# EAGLE design rx_315mhz (EAGLE 7.6.0)
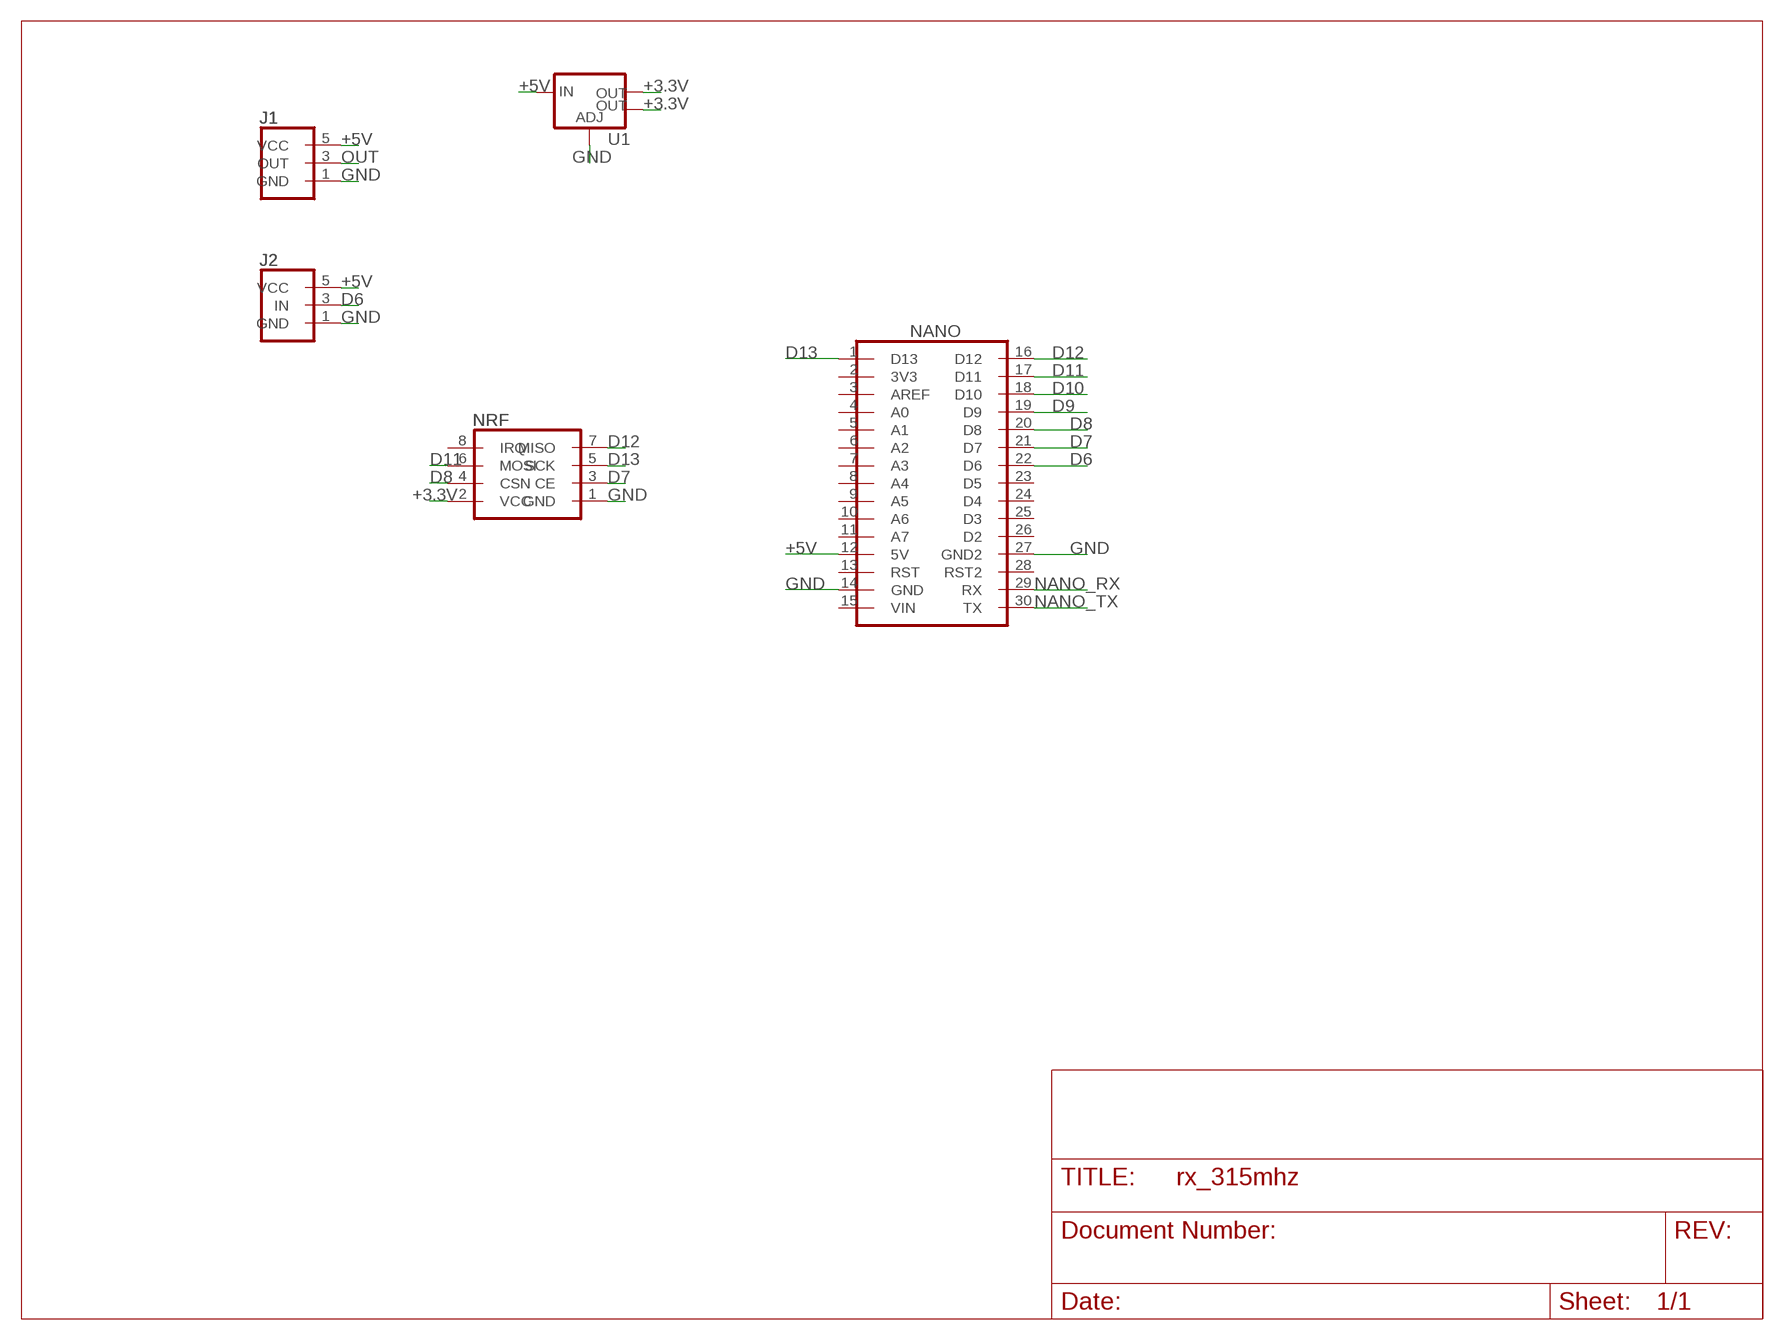
[diagram p0: schematic, sheet 1]

## Parts
J1  OUT_HEAD_3BIG  [OUT_HEAD_3_BIG]
J2  315MHZ_TX  [315MHZ_TX]
NANO  ARDUINO_NANO  [ARDUINO_NANO]
NRF  NRF24L01_MODULE  [NRF24L01]
U1  V_REG_LM1117SOT223  [SOT223]

## Nets
+3.3V: NRF.2(VCC) U1.2(OUT) U1.4(OUT)
+5V: J1.5(VCC) J2.5(VCC) NANO.12(5V) U1.3(IN)
D6: J2.3(IN) NANO.22(D6)
D7: NANO.21(D7) NRF.3(CE)
D8: NANO.20(D8) NRF.4(CSN)
D9: NANO.19(D9)
D10: NANO.18(D10)
D11: NANO.17(D11) NRF.6(MOSI)
D12: NANO.16(D12) NRF.7(MISO)
D13: NANO.1(D13) NRF.5(SCK)
GND: J1.1(GND) J2.1(GND) NANO.14(GND) NANO.27(GND2) NRF.1(GND) U1.1(ADJ)
NANO_RX: NANO.29(RX)
NANO_TX: NANO.30(TX)
OUT: J1.3(OUT)
Unconnected: NANO.2(3V3) NANO.3(AREF) NANO.4(A0) NANO.5(A1) NANO.6(A2) NANO.7(A3) NANO.8(A4) NANO.9(A5) NANO.10(A6) NANO.11(A7) NANO.13(RST) NANO.15(VIN) NANO.23(D5) NANO.24(D4) NANO.25(D3) NANO.26(D2) NANO.28(RST2) NRF.8(IRQ)

## Library data of the parts
J1 = rx:OUT_HEAD_3: Multi connection point. Often used as Generic Header-pin footprint for 0.1 inch spaced/style header connections On any of the 0.1 inch spaced packages, you can populate with these: Break Away Headers - Straight <https://www.sparkfun.com/products/116> (PRT-00116) Break Away Male Headers - Right Angle <https://www.sparkfun.com/products/553> (PRT-00553) Female Headers <https://www.sparkfun.com/products/115> (PRT-00115) Break Away Headers - Machine Pin <https://www.sparkfun.com/products/117> (PRT-00117) Break Away Female Headers - Swiss Machine Pin <https://www.sparkfun.com/products/743> (PRT-00743)
J2 = rx:315MHZ_TX: Multi connection point. Often used as Generic Header-pin footprint for 0.1 inch spaced/style header connections On any of the 0.1 inch spaced packages, you can populate with these: Break Away Headers - Straight <https://www.sparkfun.com/products/116> (PRT-00116) Break Away Male Headers - Right Angle <https://www.sparkfun.com/products/553> (PRT-00553) Female Headers <https://www.sparkfun.com/products/115> (PRT-00115) Break Away Headers - Machine Pin <https://www.sparkfun.com/products/117> (PRT-00117) Break Away Female Headers - Swiss Machine Pin <https://www.sparkfun.com/products/743> (PRT-00743)
NANO = rx:ARDUINO_NANO: Multi connection point. Often used as Generic Header-pin footprint for 0.1 inch spaced/style header connections On any of the 0.1 inch spaced packages, you can populate with these: Break Away Headers - Straight <https://www.sparkfun.com/products/116> (PRT-00116) Break Away Male Headers - Right Angle <https://www.sparkfun.com/products/553> (PRT-00553) Female Headers <https://www.sparkfun.com/products/115> (PRT-00115) Break Away Headers - Machine Pin <https://www.sparkfun.com/products/117> (PRT-00117) Break Away Female Headers - Swiss Machine Pin <https://www.sparkfun.com/products/743> (PRT-00743) For SCREWTERMINALS and SPRING TERMINALS visit here: Screw Terimnals on SparkFun.com <https://www.sparkfun.com/search/results?term=Screw+Terminals> (5mm/3.5mm/2.54mm spacing) This device is also useful as a general connection point to wire up your design to another part of your project. Our various solder wires solder well into these plated through hole pads. Hook-Up Wire - Assortment (Stranded, 22 AWG) <https://www.sparkfun.com/products/11375> (PRT-11375) Hook-Up Wire - Assortment (Solid Core, 22 AWG) <https://www.sparkfun.com/products/11367> (PRT-11367) View the entire wire category on our website here <https://www.sparkfun.com/categories/141> Special notes: Molex polarized connector foot print use with SKU : PRT-08231 with associated crimp pins and housings. 1MM SMD Version SKU: PRT-10208 NOTES ON THE VARIANTS LOCK and LOCK_LONGPADS... This footprint was designed to help hold the alignment of a through-hole component (i.e. 6-pin header) while soldering it into place. You may notice that each hole has been shifted either up or down by 0.005 of an inch from it's more standard position (which is a perfectly straight line). This slight alteration caused the pins (the squares in the middle) to touch the edges of the holes. Because they are alternating, it causes a "brace" to hold the component in place. 0.005 has proven to be the perfect amount of "off-center" position when using our standard breakaway headers. Although looks a little odd when you look at the bare footprint, once you have a header in there, the alteration is very hard to notice. Also,if you push a header all the way into place, it is covered up entirely on the bottom side.
NRF = rx:NRF24L01_MODULE: Multi connection point. Often used as Generic Header-pin footprint for 0.1 inch spaced/style header connections On any of the 0.1 inch spaced packages, you can populate with these: Break Away Headers - Straight <https://www.sparkfun.com/products/116> (PRT-00116) Break Away Male Headers - Right Angle <https://www.sparkfun.com/products/553> (PRT-00553) Female Headers <https://www.sparkfun.com/products/115> (PRT-00115) Break Away Headers - Machine Pin <https://www.sparkfun.com/products/117> (PRT-00117) Break Away Female Headers - Swiss Machine Pin <https://www.sparkfun.com/products/743> (PRT-00743)
U1 = rx:V_REG_LM1117: Voltage Regulator LM1117 Standard adjustable voltage regulator but in SMD form. Spark Fun Electronics SKU : COM-00595; PROD_ID: VREG-08170

## Board
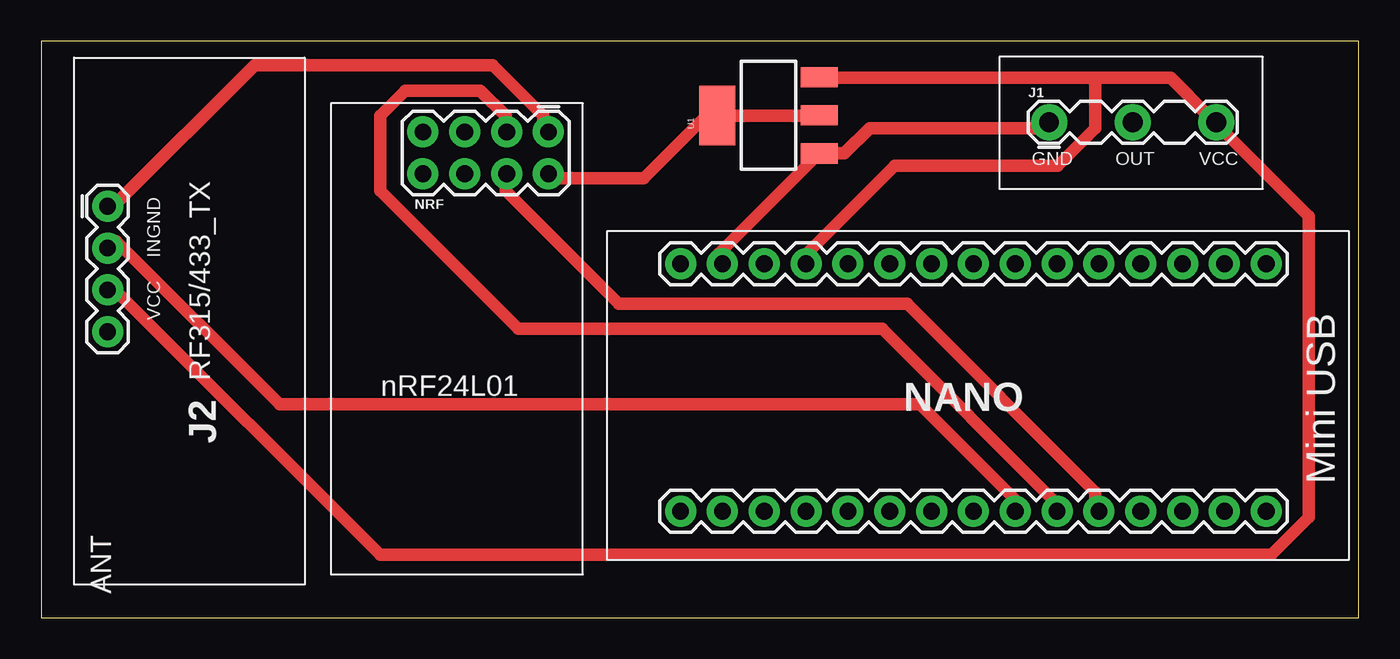
[diagram p1: board, top side]
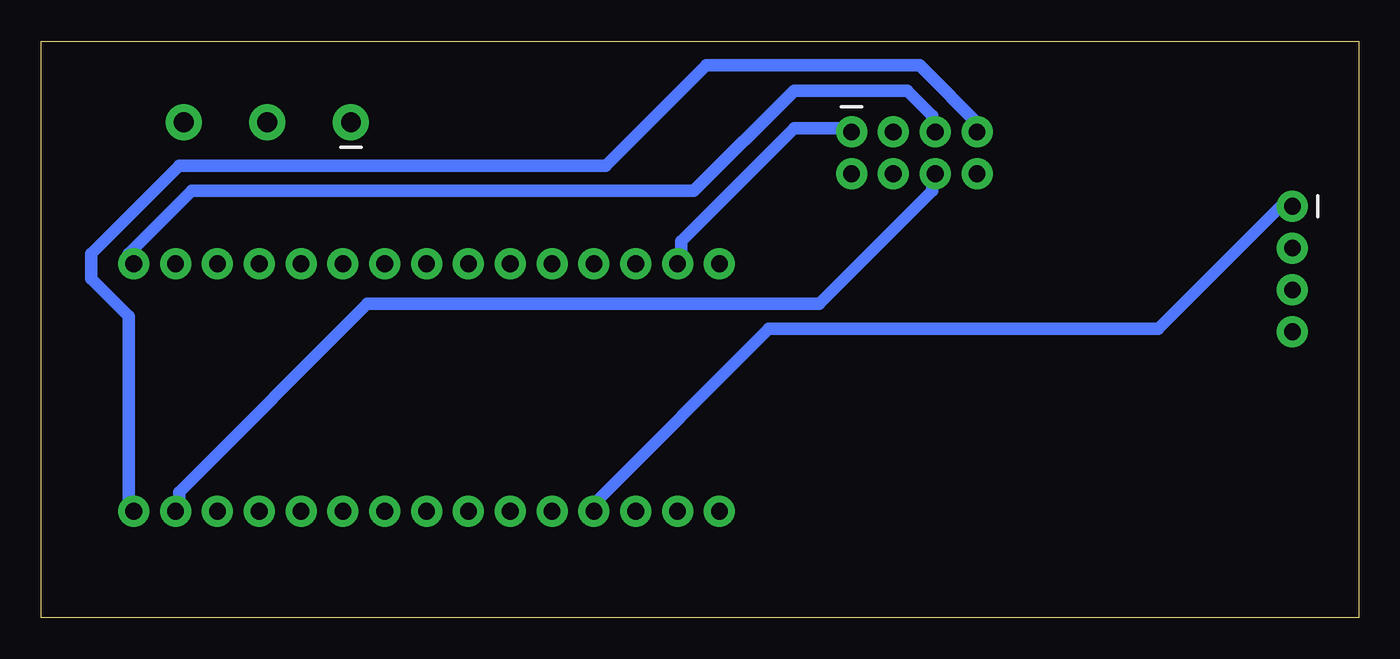
[diagram p2: board, bottom side, seen from below]

Size 80 x 35 mm. Coordinates in mm from the lower left corner, seen from the top.
Outline: 0,0 80,0 80,35 0,35 0,0
Copper layers (1*16): Top 0.035mm / dielectric 1.5mm / Bottom 0.035mm
Design rules "default *": minimum track width 30mil, minimum drill 24mil, track to track 30mil, track to pad 30mil, pad to pad 8mil, via to via 8mil, smd to smd 8mil, copper to edge 40mil, drill to drill 8mil, minimum pad ring 10mil, minimum via ring 8mil, stop-mask expansion 4mil, vias tented up to drill 0mil, thermal gap 10mil

### Footprints (pad centres in the part's own frame; a part is rotated, then mirrored left to right if it is on the bottom)
OUT_HEAD_3_BIG = drill 1.2 pad 2.184: 1 3.02,4.03; 3 8.1,4.03; 5 13.18,4.03
315MHZ_TX = drill 1.016 pad 1.88: 1 9.02,2.03; 3 11.56,2.03; 5 14.1,2.03; 7 16.64,2.03
ARDUINO_NANO = drill 1.016 pad 1.88: 1 -10.2,-8.1; 2 -7.66,-8.1; 3 -5.12,-8.1; 4 -2.58,-8.1; 5 -0.04,-8.1; 6 2.5,-8.1; 7 5.04,-8.1; 8 7.58,-8.1; 9 10.12,-8.1; 10 12.66,-8.1; 11 15.2,-8.1; 12 17.74,-8.1; 13 20.28,-8.1; 14 22.82,-8.1; 15 25.36,-8.1; 16 -10.2,6.93; 17 -7.66,6.93; 18 -5.12,6.93; 19 -2.58,6.93; 20 -0.04,6.93; 21 2.5,6.93; 22 5.04,6.93; 23 7.58,6.93; 24 10.12,6.93; 25 12.66,6.93; 26 15.2,6.93; 27 17.74,6.93; 28 20.28,6.93; 29 22.82,6.93; 30 25.36,6.93
NRF24L01 = drill 1.016 pad 1.88: 1 -13.21,1.73; 2 -13.21,4.27; 3 -10.67,1.73; 4 -10.67,4.27; 5 -8.13,1.73; 6 -8.13,4.27; 7 -5.59,1.73; 8 -5.59,4.27
SOT223 = smd 1.219 x 2.235: 1 -2.311,-3.099; 2 0,-3.099; 3 2.311,-3.099 | smd 3.6 x 2.2: 4 0,3.099

### Placement (x,y rotation side)
J1  58.17,26.04 0 top
J2  2,34 270 top
NANO  64.18,13.39 180 top
NRF  17.59,31.22 180 top
U1  44.15,30.49 90 top

### Tracks (layer width: path | path; a pad name or v marks a point on that pad's centre or on a via)
+3.3V
  Top 0.762: U1.2 41.15,30.48 U1.4 40.39,30.48 36.58,26.67 31.24,26.67 NRF.2
+5V
  Top 0.762: 64.01,32.77 68.58,32.77 70.87,30.48 J1.5 71.63,29.72 76.96,24.38 76.96,6.1 74.68,3.81 20.57,3.81 4.57,19.81 J2.5 | 64.01,32.77 48.01,32.77 U1.3 | 64.01,32.77 64.01,29.72 61.72,27.43 51.82,27.43 46.48,22.1 NANO.12
D6
  Top 0.762: NANO.22 59.44,6.86 53.34,12.95 14.48,12.95 4.57,22.86 J2.3
D7
  Top 0.762: NANO.21 61.72,6.86 51.05,17.53 28.96,17.53 20.57,25.91 20.57,30.48 22.1,32 26.67,32 28.19,30.48 28.19,29.72 NRF.3
D8
  Top 0.762: NANO.20 64.01,6.86 64.01,7.62 52.58,19.05 35.05,19.05 28.19,25.91 28.19,26.67 NRF.4
D11
  Bottom 0.762: NANO.17 71.63,6.86 71.63,7.62 60.2,19.05 32.77,19.05 25.91,25.91 25.91,26.67 NRF.6
D12
  Bottom 0.762: NANO.16 74.68,6.86 74.68,18.29 76.96,20.57 76.96,22.1 71.63,27.43 45.72,27.43 39.62,33.53 26.67,33.53 22.86,29.72 NRF.7
D13
  Bottom 0.762: NANO.1 74.68,22.1 70.87,25.91 40.39,25.91 34.29,32 27.43,32 25.91,30.48 25.91,29.72 NRF.5
GND
  Top 0.762: NANO.14 41.15,22.1 47.24,28.19 U1.1 48.01,28.19 48.77,28.19 50.29,29.72 60.96,29.72 J1.1 | NRF.1 30.48,29.72 30.48,30.48 27.43,33.53 12.95,33.53 4.57,25.15 J2.1
  Bottom 0.762: NRF.1 31.24,29.72 34.29,29.72 41.15,22.86 41.15,22.1 NANO.14 | NANO.27 46.48,6.86 35.81,17.53 12.19,17.53 4.57,25.15 J2.1